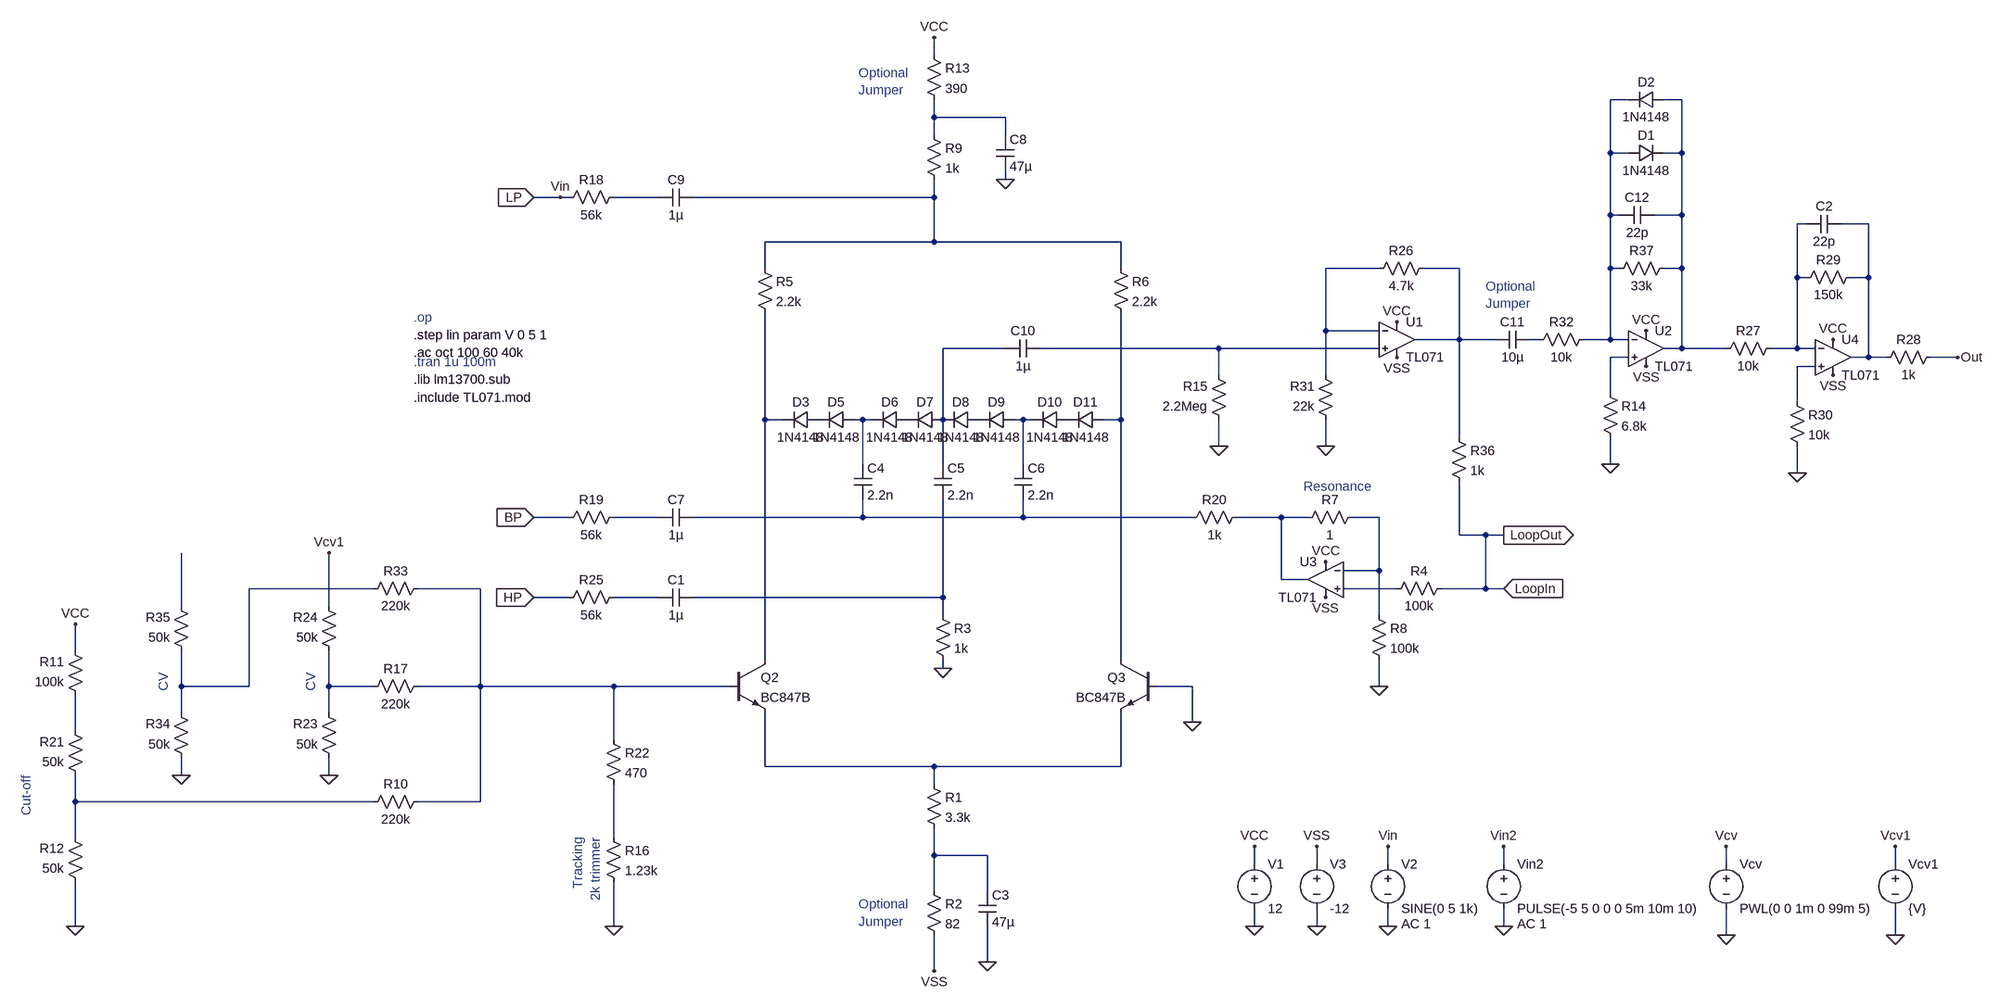
[diagram p0: schematic SteinerVCF.asc]
SteinerVCF.asc, the LTspice schematic file:
Version 4
SHEET 1 5572 1568
WIRE 3552 -656 3552 -688
WIRE 4800 -576 4768 -576
WIRE 4896 -576 4864 -576
WIRE 3552 -544 3552 -576
WIRE 3680 -544 3552 -544
WIRE 3552 -512 3552 -544
WIRE 3680 -512 3680 -544
WIRE 4768 -480 4768 -576
WIRE 4800 -480 4768 -480
WIRE 4896 -480 4896 -576
WIRE 4896 -480 4864 -480
WIRE 3680 -432 3680 -448
WIRE 2880 -400 2832 -400
WIRE 2896 -400 2880 -400
WIRE 3056 -400 2976 -400
WIRE 3552 -400 3552 -432
WIRE 3552 -400 3120 -400
WIRE 4768 -368 4768 -480
WIRE 4784 -368 4768 -368
WIRE 4896 -368 4896 -480
WIRE 4896 -368 4848 -368
WIRE 5120 -352 5104 -352
WIRE 5232 -352 5184 -352
WIRE 3552 -320 3552 -400
WIRE 3552 -320 3248 -320
WIRE 3888 -320 3552 -320
WIRE 3248 -272 3248 -320
WIRE 3888 -272 3888 -320
WIRE 4352 -272 4256 -272
WIRE 4496 -272 4432 -272
WIRE 4768 -272 4768 -368
WIRE 4784 -272 4768 -272
WIRE 4896 -272 4896 -368
WIRE 4896 -272 4864 -272
WIRE 5104 -256 5104 -352
WIRE 5120 -256 5104 -256
WIRE 5232 -256 5232 -352
WIRE 5232 -256 5200 -256
WIRE 4256 -160 4256 -272
WIRE 4352 -160 4256 -160
WIRE 4496 -144 4496 -272
WIRE 4496 -144 4416 -144
WIRE 4560 -144 4496 -144
WIRE 4640 -144 4624 -144
WIRE 4768 -144 4768 -272
WIRE 4768 -144 4720 -144
WIRE 4800 -144 4768 -144
WIRE 3680 -128 3568 -128
WIRE 4064 -128 3744 -128
WIRE 4352 -128 4064 -128
WIRE 4896 -128 4896 -272
WIRE 4896 -128 4864 -128
WIRE 4976 -128 4896 -128
WIRE 5104 -128 5104 -256
WIRE 5104 -128 5056 -128
WIRE 5136 -128 5104 -128
WIRE 4800 -112 4768 -112
WIRE 5232 -112 5232 -256
WIRE 5232 -112 5200 -112
WIRE 5264 -112 5232 -112
WIRE 5392 -112 5344 -112
WIRE 5136 -96 5104 -96
WIRE 4064 -80 4064 -128
WIRE 4256 -80 4256 -160
WIRE 4768 -48 4768 -112
WIRE 5104 -32 5104 -96
WIRE 3248 0 3248 -192
WIRE 3280 0 3248 0
WIRE 3424 0 3408 0
WIRE 3440 0 3424 0
WIRE 3568 0 3568 -128
WIRE 3712 0 3696 0
WIRE 3728 0 3712 0
WIRE 3888 0 3888 -192
WIRE 3888 0 3856 0
WIRE 4496 32 4496 -144
WIRE 4064 48 4064 0
WIRE 4256 48 4256 0
WIRE 3424 80 3424 0
WIRE 3568 80 3568 0
WIRE 3712 80 3712 0
WIRE 4768 80 4768 32
WIRE 5104 96 5104 48
WIRE 2896 176 2832 176
WIRE 3056 176 2976 176
WIRE 3424 176 3424 144
WIRE 3424 176 3120 176
WIRE 3712 176 3712 144
WIRE 3712 176 3424 176
WIRE 4016 176 3712 176
WIRE 4176 176 4096 176
WIRE 4224 176 4176 176
WIRE 4352 176 4304 176
WIRE 4496 208 4496 112
WIRE 4544 208 4496 208
WIRE 4576 208 4544 208
WIRE 4352 272 4352 176
WIRE 4352 272 4288 272
WIRE 4176 288 4176 176
WIRE 4224 288 4176 288
WIRE 2544 304 2320 304
WIRE 2736 304 2624 304
WIRE 4384 304 4288 304
WIRE 4544 304 4544 208
WIRE 4544 304 4464 304
WIRE 4576 304 4544 304
WIRE 2896 320 2832 320
WIRE 3056 320 2976 320
WIRE 3568 320 3568 144
WIRE 3568 320 3120 320
WIRE 2160 336 2160 240
WIRE 2464 336 2464 240
WIRE 3568 352 3568 320
WIRE 4352 352 4352 272
WIRE 1968 416 1968 368
WIRE 3248 432 3248 0
WIRE 3888 432 3888 0
WIRE 3568 448 3568 432
WIRE 2160 480 2160 416
WIRE 2320 480 2320 304
WIRE 2320 480 2160 480
WIRE 2464 480 2464 416
WIRE 2544 480 2464 480
WIRE 2736 480 2736 304
WIRE 2736 480 2624 480
WIRE 2976 480 2736 480
WIRE 3184 480 2976 480
WIRE 4016 480 3952 480
WIRE 4352 480 4352 432
WIRE 2160 528 2160 480
WIRE 2464 528 2464 480
WIRE 4016 544 4016 480
WIRE 1968 560 1968 496
WIRE 2976 576 2976 480
WIRE 3248 624 3248 528
WIRE 3552 624 3248 624
WIRE 3888 624 3888 528
WIRE 3888 624 3552 624
WIRE 2160 640 2160 608
WIRE 2464 640 2464 608
WIRE 3552 656 3552 624
WIRE 1968 688 1968 640
WIRE 2544 688 1968 688
WIRE 2736 688 2736 480
WIRE 2736 688 2624 688
WIRE 1968 752 1968 688
WIRE 2976 752 2976 656
WIRE 3552 784 3552 736
WIRE 3648 784 3552 784
WIRE 4128 800 4128 768
WIRE 4240 800 4240 768
WIRE 4368 800 4368 768
WIRE 4576 800 4576 768
WIRE 4976 800 4976 768
WIRE 5280 800 5280 768
WIRE 3552 848 3552 784
WIRE 3648 848 3648 784
WIRE 1968 912 1968 832
WIRE 2976 912 2976 832
WIRE 4128 912 4128 880
WIRE 4240 912 4240 880
WIRE 4368 912 4368 880
WIRE 4576 912 4576 880
WIRE 4976 928 4976 880
WIRE 5280 928 5280 880
WIRE 3648 976 3648 912
WIRE 3552 992 3552 928
FLAG 4128 912 0
FLAG 4128 768 VCC
FLAG 4240 912 0
FLAG 4240 768 VSS
FLAG 4368 912 0
FLAG 4368 768 Vin
FLAG 4976 928 0
FLAG 4976 768 Vcv
FLAG 3648 976 0
FLAG 3552 992 VSS
FLAG 3568 448 0
FLAG 3680 -432 0
FLAG 3552 -688 VCC
FLAG 4016 544 0
FLAG 2976 912 0
FLAG 2464 240 Vcv1
FLAG 2880 -400 Vin
FLAG 5280 928 0
FLAG 5280 768 Vcv1
FLAG 4064 48 0
FLAG 4384 -176 VCC
FLAG 4384 -112 VSS
FLAG 4256 48 0
FLAG 4768 80 0
FLAG 4832 -96 VSS
FLAG 4832 -160 VCC
FLAG 4256 256 VCC
FLAG 4256 320 VSS
FLAG 4352 480 0
FLAG 1968 912 0
FLAG 1968 368 VCC
FLAG 2464 640 0
FLAG 5104 96 0
FLAG 5168 -80 VSS
FLAG 5168 -144 VCC
FLAG 5392 -112 Out
FLAG 2832 -400 LP
IOPIN 2832 -400 In
FLAG 2832 176 BP
IOPIN 2832 176 In
FLAG 2832 320 HP
IOPIN 2832 320 In
FLAG 4576 912 0
FLAG 4576 768 Vin2
FLAG 2160 640 0
FLAG 4576 208 LoopOut
IOPIN 4576 208 Out
FLAG 4576 304 LoopIn
IOPIN 4576 304 In
DATAFLAG 2864 480 "$"
DATAFLAG 3632 -544 "$"
DATAFLAG 3744 -320 "$"
DATAFLAG 3888 272 "$"
DATAFLAG 3744 624 "$"
DATAFLAG 2080 688 "$"
DATAFLAG 2464 272 "$"
DATAFLAG 3248 -96 "$"
DATAFLAG 2160 272 "$"
SYMBOL voltage 4128 784 R0
WINDOW 123 0 0 Left 2
WINDOW 39 0 0 Left 2
SYMATTR InstName V1
SYMATTR Value 12
SYMBOL voltage 4368 784 R0
WINDOW 123 24 124 Left 2
WINDOW 39 0 0 Left 2
SYMATTR Value2 AC 1
SYMATTR InstName V2
SYMATTR Value SINE(0 5 1k)
SYMBOL voltage 4240 784 R0
WINDOW 123 0 0 Left 2
WINDOW 39 0 0 Left 2
SYMATTR InstName V3
SYMATTR Value -12
SYMBOL voltage 4976 784 R0
WINDOW 123 24 124 Left 2
WINDOW 39 0 0 Left 2
SYMATTR InstName Vcv
SYMATTR Value PWL(0 0 1m 0 99m 5)
SYMBOL npn 3184 432 R0
SYMATTR InstName Q2
SYMATTR Value BC847B
SYMBOL npn 3952 432 M0
SYMATTR InstName Q3
SYMATTR Value BC847B
SYMBOL res 3536 640 R0
SYMATTR InstName R1
SYMATTR Value 3.3k
SYMBOL res 3536 832 R0
SYMATTR InstName R2
SYMATTR Value 82
SYMBOL cap 3632 848 R0
SYMATTR InstName C3
SYMATTR Value 47µ
SYMBOL diode 3344 -16 R90
WINDOW 0 0 32 VBottom 2
WINDOW 3 32 32 VTop 2
SYMATTR InstName D3
SYMATTR Value 1N4148
SYMBOL diode 3408 -16 R90
WINDOW 0 0 32 VBottom 2
WINDOW 3 32 32 VTop 2
SYMATTR InstName D5
SYMATTR Value 1N4148
SYMBOL diode 3504 -16 R90
WINDOW 0 0 32 VBottom 2
WINDOW 3 32 32 VTop 2
SYMATTR InstName D6
SYMATTR Value 1N4148
SYMBOL diode 3568 -16 R90
WINDOW 0 0 32 VBottom 2
WINDOW 3 32 32 VTop 2
SYMATTR InstName D7
SYMATTR Value 1N4148
SYMBOL diode 3632 -16 R90
WINDOW 0 0 32 VBottom 2
WINDOW 3 32 32 VTop 2
SYMATTR InstName D8
SYMATTR Value 1N4148
SYMBOL diode 3696 -16 R90
WINDOW 0 0 32 VBottom 2
WINDOW 3 32 32 VTop 2
SYMATTR InstName D9
SYMATTR Value 1N4148
SYMBOL diode 3792 -16 R90
WINDOW 0 0 32 VBottom 2
WINDOW 3 32 32 VTop 2
SYMATTR InstName D10
SYMATTR Value 1N4148
SYMBOL diode 3856 -16 R90
WINDOW 0 0 32 VBottom 2
WINDOW 3 32 32 VTop 2
SYMATTR InstName D11
SYMATTR Value 1N4148
SYMBOL cap 3408 80 R0
SYMATTR InstName C4
SYMATTR Value 2.2n
SYMBOL cap 3552 80 R0
SYMATTR InstName C5
SYMATTR Value 2.2n
SYMBOL cap 3696 80 R0
SYMATTR InstName C6
SYMATTR Value 2.2n
SYMBOL res 3552 336 R0
SYMATTR InstName R3
SYMATTR Value 1k
SYMBOL cap 3120 160 R90
WINDOW 0 0 32 VBottom 2
WINDOW 3 32 32 VTop 2
SYMATTR InstName C7
SYMATTR Value 1µ
SYMBOL res 3232 -288 R0
SYMATTR InstName R5
SYMATTR Value 2.2k
SYMBOL res 3872 -288 R0
SYMATTR InstName R6
SYMATTR Value 2.2k
SYMBOL res 3536 -528 R0
SYMATTR InstName R9
SYMATTR Value 1k
SYMBOL res 3536 -672 R0
SYMATTR InstName R13
SYMATTR Value 390
SYMBOL cap 3664 -512 R0
SYMATTR InstName C8
SYMATTR Value 47µ
SYMBOL cap 3120 -416 R90
WINDOW 0 0 32 VBottom 2
WINDOW 3 32 32 VTop 2
SYMATTR InstName C9
SYMATTR Value 1µ
SYMBOL res 2960 736 R0
SYMATTR InstName R16
SYMATTR Value 1.23k
SYMBOL cap 3744 -144 R90
WINDOW 0 0 32 VBottom 2
WINDOW 3 32 32 VTop 2
SYMATTR InstName C10
SYMATTR Value 1µ
SYMBOL res 2640 464 R90
WINDOW 0 0 56 VBottom 2
WINDOW 3 32 56 VTop 2
SYMATTR InstName R17
SYMATTR Value 220k
SYMBOL res 2992 -416 R90
WINDOW 0 0 56 VBottom 2
WINDOW 3 32 56 VTop 2
SYMATTR InstName R18
SYMATTR Value 56k
SYMBOL res 2992 160 R90
WINDOW 0 0 56 VBottom 2
WINDOW 3 32 56 VTop 2
SYMATTR InstName R19
SYMATTR Value 56k
SYMBOL res 4112 160 R90
WINDOW 0 0 56 VBottom 2
WINDOW 3 32 56 VTop 2
SYMATTR InstName R20
SYMATTR Value 1k
SYMBOL res 2992 304 R90
WINDOW 0 0 56 VBottom 2
WINDOW 3 32 56 VTop 2
SYMATTR InstName R25
SYMATTR Value 56k
SYMBOL voltage 5280 784 R0
WINDOW 123 24 124 Left 2
WINDOW 39 0 0 Left 2
SYMATTR InstName Vcv1
SYMATTR Value {V}
SYMBOL res 4080 16 R180
WINDOW 0 36 76 Left 2
WINDOW 3 36 40 Left 2
SYMATTR InstName R15
SYMATTR Value 2.2Meg
SYMBOL opamp2 4384 -208 R0
SYMATTR InstName U1
SYMATTR Value TL071
SYMBOL res 4448 -288 R90
WINDOW 0 0 56 VBottom 2
WINDOW 3 32 56 VTop 2
SYMATTR InstName R26
SYMATTR Value 4.7k
SYMBOL res 4272 16 R180
WINDOW 0 36 76 Left 2
WINDOW 3 36 40 Left 2
SYMATTR InstName R31
SYMATTR Value 22k
SYMBOL cap 4624 -160 R90
WINDOW 0 0 32 VBottom 2
WINDOW 3 32 32 VTop 2
SYMATTR InstName C11
SYMATTR Value 10µ
SYMBOL res 4736 -160 R90
WINDOW 0 0 56 VBottom 2
WINDOW 3 32 56 VTop 2
SYMATTR InstName R32
SYMATTR Value 10k
SYMBOL opamp2 4832 -192 R0
SYMATTR InstName U2
SYMATTR Value TL071
SYMBOL res 4880 -288 R90
WINDOW 0 0 56 VBottom 2
WINDOW 3 32 56 VTop 2
SYMATTR InstName R37
SYMATTR Value 33k
SYMBOL cap 4848 -384 R90
WINDOW 0 0 32 VBottom 2
WINDOW 3 32 32 VTop 2
SYMATTR InstName C12
SYMATTR Value 22p
SYMBOL opamp2 4256 224 M0
SYMATTR InstName U3
SYMATTR Value TL071
SYMBOL res 2640 672 R90
WINDOW 0 0 56 VBottom 2
WINDOW 3 32 56 VTop 2
SYMATTR InstName R10
SYMATTR Value 220k
SYMBOL res 1984 512 R180
WINDOW 0 36 76 Left 2
WINDOW 3 36 40 Left 2
SYMATTR InstName R11
SYMATTR Value 100k
SYMBOL res 1984 848 R180
WINDOW 0 36 76 Left 2
WINDOW 3 36 40 Left 2
SYMATTR InstName R12
SYMATTR Value 50k
SYMBOL res 1984 656 R180
WINDOW 0 36 76 Left 2
WINDOW 3 36 40 Left 2
SYMATTR InstName R21
SYMATTR Value 50k
SYMBOL res 2960 560 R0
SYMATTR InstName R22
SYMATTR Value 470
SYMBOL res 2480 624 R180
WINDOW 0 36 76 Left 2
WINDOW 3 36 40 Left 2
SYMATTR InstName R23
SYMATTR Value 50k
SYMBOL res 2480 432 R180
WINDOW 0 36 76 Left 2
WINDOW 3 36 40 Left 2
SYMATTR InstName R24
SYMATTR Value 50k
SYMBOL cap 3120 304 R90
WINDOW 0 0 32 VBottom 2
WINDOW 3 32 32 VTop 2
SYMATTR InstName C1
SYMATTR Value 1µ
SYMBOL res 4368 320 R270
WINDOW 0 32 56 VTop 2
WINDOW 3 0 56 VBottom 2
SYMATTR InstName R4
SYMATTR Value 100k
SYMBOL res 4208 192 R270
WINDOW 0 32 56 VTop 2
WINDOW 3 0 56 VBottom 2
SYMATTR InstName R7
SYMATTR Value 1
SYMBOL res 4336 336 R0
SYMATTR InstName R8
SYMATTR Value 100k
SYMBOL res 4752 -64 R0
SYMATTR InstName R14
SYMATTR Value 6.8k
SYMBOL res 5072 -144 R90
WINDOW 0 0 56 VBottom 2
WINDOW 3 32 56 VTop 2
SYMATTR InstName R27
SYMATTR Value 10k
SYMBOL opamp2 5168 -176 R0
SYMATTR InstName U4
SYMATTR Value TL071
SYMBOL res 5360 -128 R90
WINDOW 0 0 56 VBottom 2
WINDOW 3 32 56 VTop 2
SYMATTR InstName R28
SYMATTR Value 1k
SYMBOL res 5216 -272 R90
WINDOW 0 0 56 VBottom 2
WINDOW 3 32 56 VTop 2
SYMATTR InstName R29
SYMATTR Value 150k
SYMBOL cap 5184 -368 R90
WINDOW 0 0 32 VBottom 2
WINDOW 3 32 32 VTop 2
SYMATTR InstName C2
SYMATTR Value 22p
SYMBOL res 5088 -48 R0
SYMATTR InstName R30
SYMATTR Value 10k
SYMBOL voltage 4576 784 R0
WINDOW 123 24 124 Left 2
WINDOW 39 0 0 Left 2
SYMATTR Value2 AC 1
SYMATTR InstName Vin2
SYMATTR Value PULSE(-5 5 0 0 0 5m 10m 10)
SYMBOL diode 4800 -464 R270
WINDOW 0 32 32 VTop 2
WINDOW 3 0 32 VBottom 2
SYMATTR InstName D1
SYMATTR Value 1N4148
SYMBOL diode 4864 -592 R90
WINDOW 0 0 32 VBottom 2
WINDOW 3 32 32 VTop 2
SYMATTR InstName D2
SYMATTR Value 1N4148
SYMBOL res 2640 288 R90
WINDOW 0 0 56 VBottom 2
WINDOW 3 32 56 VTop 2
SYMATTR InstName R33
SYMATTR Value 220k
SYMBOL res 2176 624 R180
WINDOW 0 36 76 Left 2
WINDOW 3 36 40 Left 2
SYMATTR InstName R34
SYMATTR Value 50k
SYMBOL res 2176 432 R180
WINDOW 0 36 76 Left 2
WINDOW 3 36 40 Left 2
SYMATTR InstName R35
SYMATTR Value 50k
SYMBOL res 4480 16 R0
SYMATTR InstName R36
SYMATTR Value 1k
TEXT 2616 -72 Left 2 !.lib lm13700.sub
TEXT 2616 -104 Left 2 ;.tran 1u 100m
TEXT 2616 -40 Left 2 !.include TL071.mod
TEXT 2616 -152 Left 2 !.step lin param V 0 5 1\n.ac oct 100 60 40k
TEXT 2616 -184 Left 2 ;.op
TEXT 4216 120 Left 2 ;Resonance
TEXT 2912 752 VRight 2 ;Tracking\n2k trimmer
TEXT 1880 640 VRight 2 ;Cut-off
TEXT 2432 456 VRight 2 ;CV
TEXT 4544 -240 Left 2 ;Optional\nJumper
TEXT 3416 872 Left 2 ;Optional\nJumper
TEXT 3416 -624 Left 2 ;Optional\nJumper
TEXT 2128 456 VRight 2 ;CV

The netlist it stands for:
* SteinerVCF.asc
V1 VCC 0 12
V2 LP 0 SINE(0 5 1k) AC 1
V3 VSS 0 -12
Vcv Vcv 0 PWL(0 0 1m 0 99m 5)
Q2 N015 N024 N031 0 BC847B
Q3 N018 0 N031 0 BC847B
R1 N031 N034 3.3k
R2 N034 VSS 82
C3 N034 0 47µ
D3 P001 N015 1N4148
D5 N016 P001 1N4148
D6 P002 N016 1N4148
D7 N011 P002 1N4148
D8 P003 N011 1N4148
D9 N017 P003 1N4148
D10 P004 N017 1N4148
D11 N018 P004 1N4148
C4 N016 N020 2.2n
C5 N011 N027 2.2n
C6 N017 N020 2.2n
R3 N027 0 1k
C7 N020 N019 1µ
R5 N005 N015 2.2k
R6 N005 N018 2.2k
R9 N003 N005 1k
R13 VCC N003 390
C8 N003 0 47µ
C9 N005 N004 1µ
R16 N033 0 1.23k
C10 N012 N011 1µ
R17 N024 N029 220k
R18 N004 LP 56k
R19 N019 BP 56k
R20 N021 N020 1k
R25 N026 HP 56k
Vcv1 Vcv1 0 {V}
R15 0 N012 2.2Meg
XU1 N012 N008 VCC VSS N009 TL071  ; pins In+ In- V+ V- OUT
R26 N009 N008 4.7k
R31 0 N008 22k
C11 N010 N009 10µ
R32 N001 N010 10k
XU2 N013 N001 VCC VSS N002 TL071  ; pins In+ In- V+ V- OUT
R37 N002 N001 33k
C12 N002 N001 22p
XU3 N025 N022 VCC VSS N021 TL071  ; pins In+ In- V+ V- OUT
R10 N024 N032 220k
R11 N030 VCC 100k
R12 0 N032 50k
R21 N032 N030 50k
R22 N024 N033 470
R23 0 N029 50k
R24 N029 Vcv1 50k
C1 N027 N026 1µ
R4 N025 LoopIn 100k
R7 N021 N022 1
R8 N022 0 100k
R14 N013 0 6.8k
R27 N006 N002 10k
XU4 N014 N006 VCC VSS N007 TL071  ; pins In+ In- V+ V- OUT
R28 Out N007 1k
R29 N007 N006 150k
C2 N007 N006 22p
R30 N014 0 10k
Vin2 Vin2 0 PULSE(-5 5 0 0 0 5m 10m 10) AC 1
D1 N001 N002 1N4148
D2 N002 N001 1N4148
R33 N024 N023 220k
R34 0 N023 50k
R35 N023 N028 50k
R36 N009 LoopIn 1k
.model D D
.lib standard.dio
.model NPN NPN
.model PNP PNP
.lib standard.bjt
.lib lm13700.sub
* .tran 1u 100m
.include TL071.mod
.step lin param V 0 5 1
.ac oct 100 60 40k
* .op
* Resonance
* Tracking
* 2k trimmer
* Cut-off
* CV
* Optional
* Jumper
* Optional
* Jumper
* Optional
* Jumper
* CV
.backanno
.end